# Altium schematic sheet 13_MRAM_RTC_WDT.SchDoc
size 420 x 297 mm; SheetNumber: 22; SheetTotal: 36
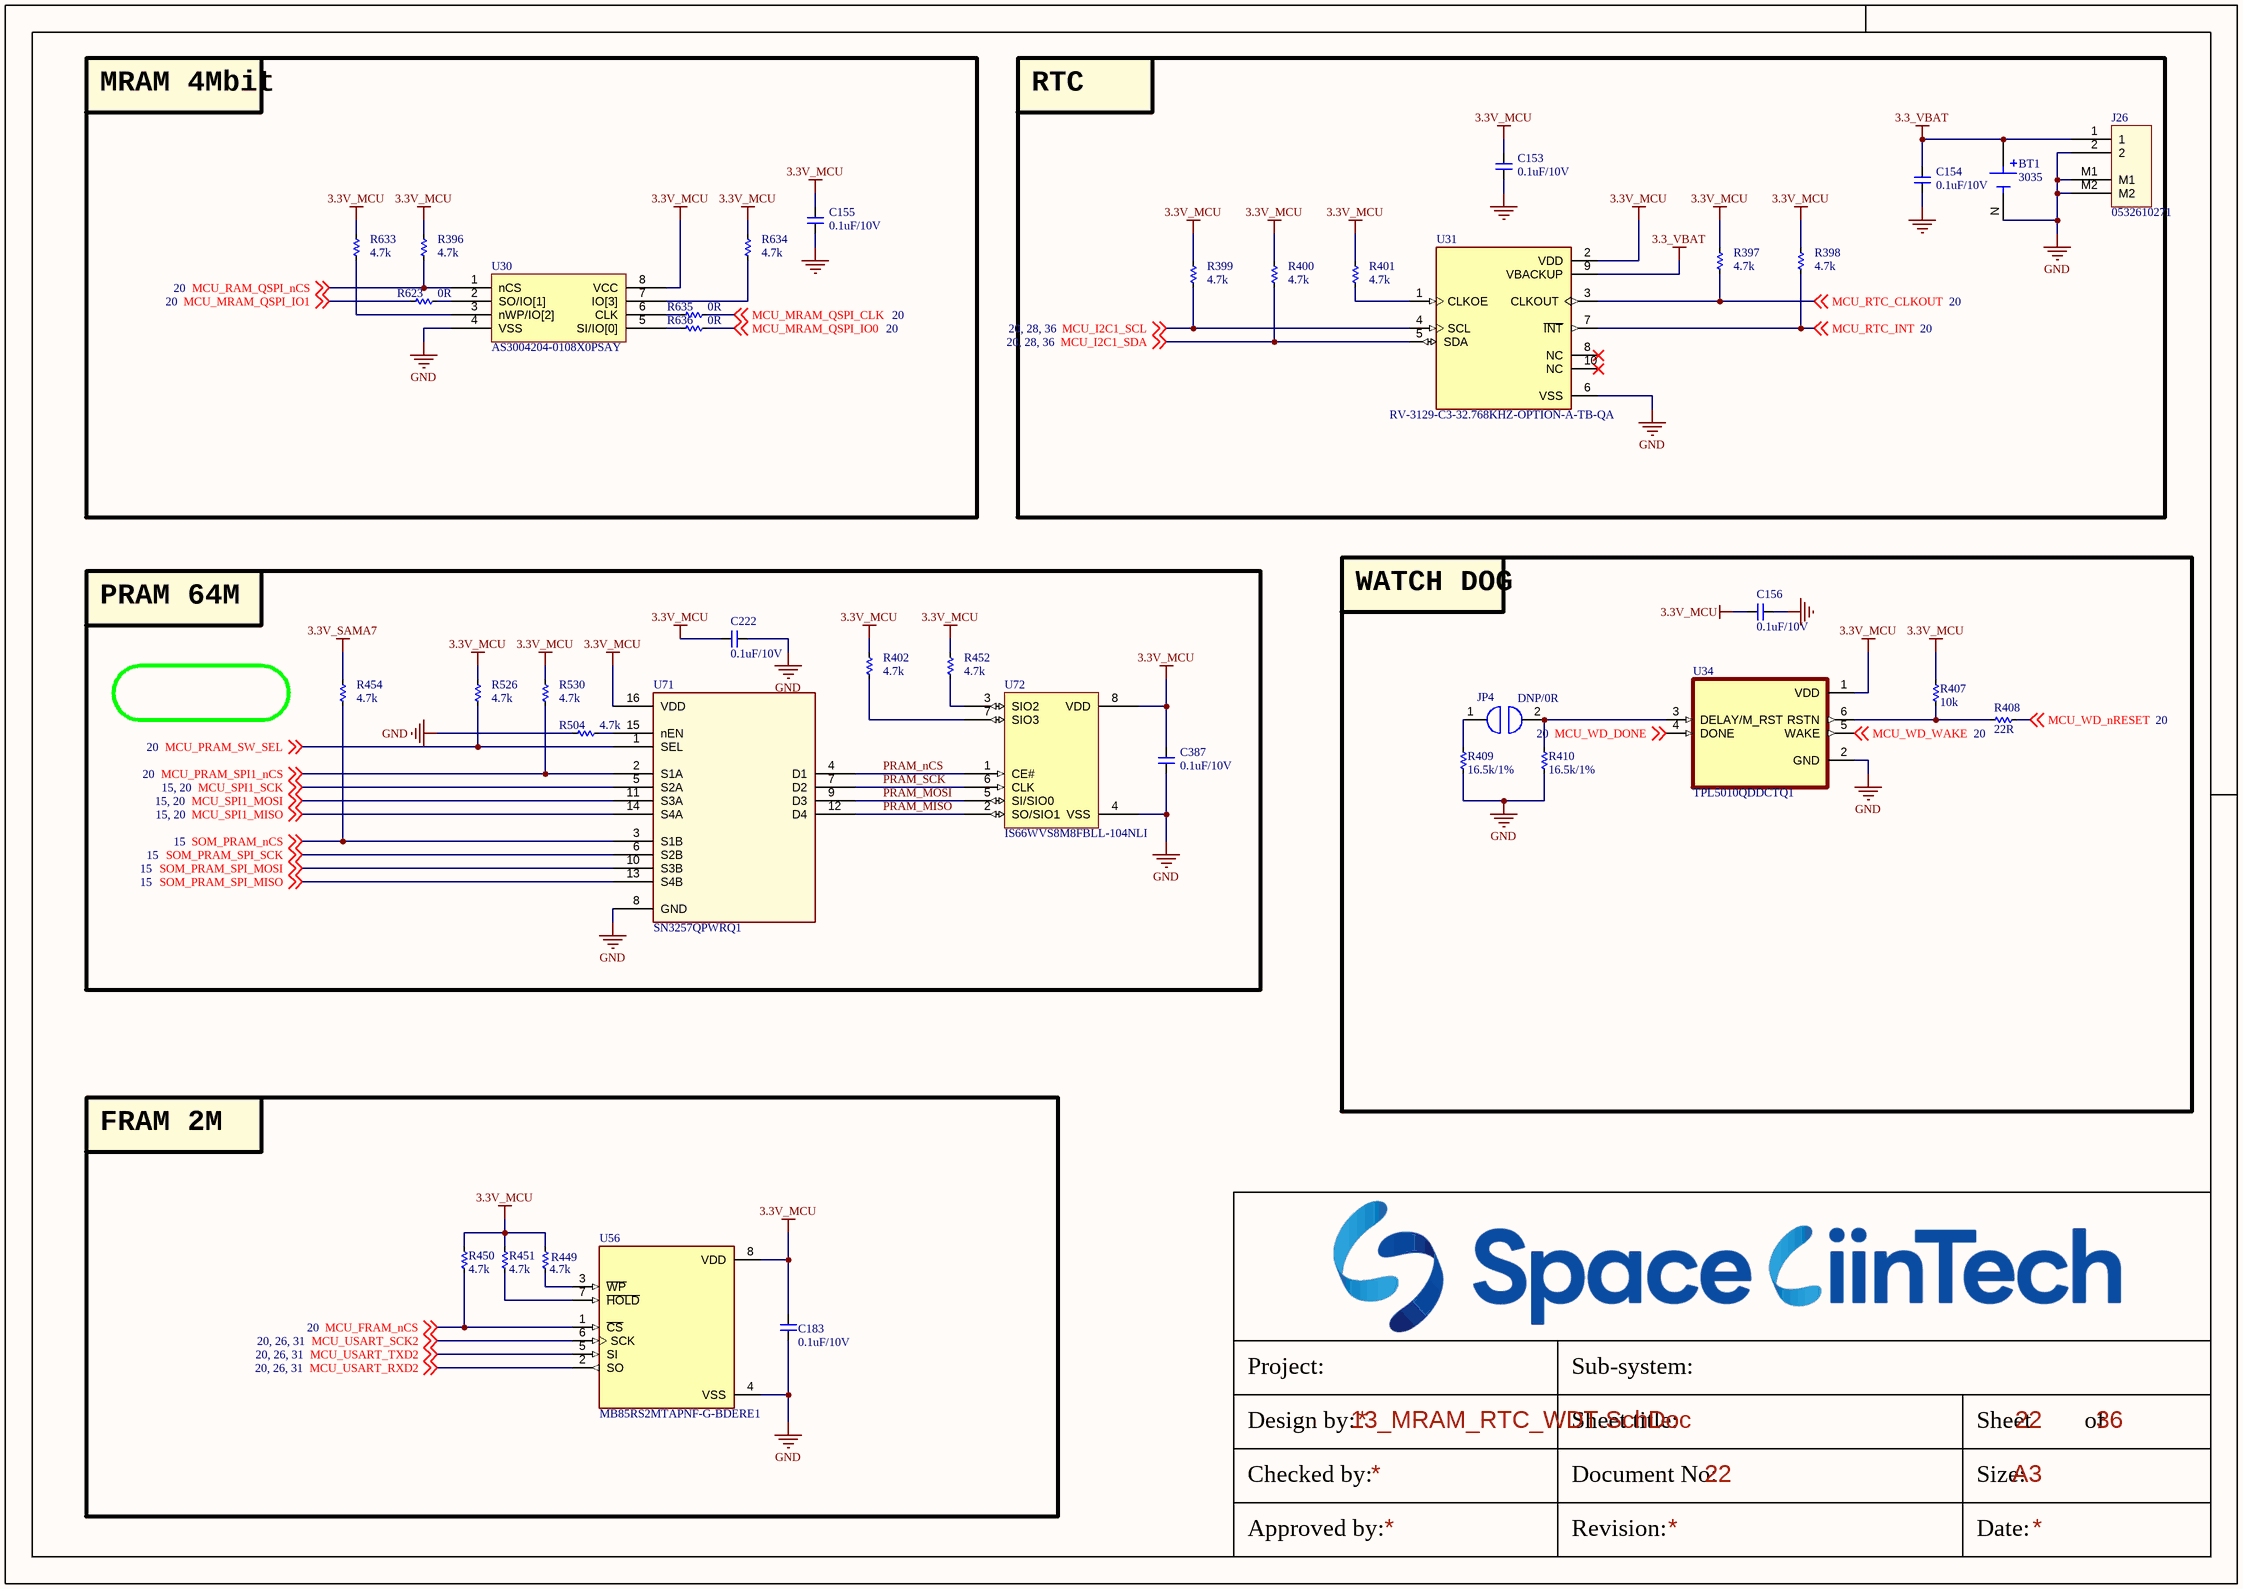
[diagram p0: 13_MRAM_RTC_WDT.SchDoc]

## Parts
BT1  3035  [BAT_3035]
C153  0.1uF/10V  [CAP_C_1005X60]
C154  0.1uF/10V  [CAP_C_1005X60]
C155  0.1uF/10V  [CAP_C_1005X60]
C156  0.1uF/10V  [CAP_C_1005X60]
C183  0.1uF/10V  [CAP_C_1005X60]
C222  0.1uF/10V  [CAP_C_1005X60]
C387  0.1uF/10V  [CAP_C_1005X60]
J26  0532610271  [molex_0532610271]
JP4  DNP/0R  [JUMPER_1608]
R396  4.7k  [RES_C_1005X40]
R397  4.7k  [RES_C_1005X40]
R398  4.7k  [RES_C_1005X40]
R399  4.7k  [RES_C_1005X40]
R400  4.7k  [RES_C_1005X40]
R401  4.7k  [RES_C_1005X40]
R402  4.7k  [RES_C_1005X40]
R407  10k  [RES_C_1005X40]
R408  22R  [RES_C_1005X40]
R409  16.5k/1%  [RES_C_1005X40]
R410  16.5k/1%  [RES_C_1005X40]
R449  4.7k  [RES_C_1005X40]
R450  4.7k  [RES_C_1005X40]
R451  4.7k  [RES_C_1005X40]
R452  4.7k  [RES_C_1005X40]
R454  4.7k  [RES_C_1005X40]
R504  4.7k  [RES_C_1005X40]
R526  4.7k  [RES_C_1005X40]
R530  4.7k  [RES_C_1005X40]
R623  0R  [RES_C_1005X40]
R633  4.7k  [RES_C_1005X40]
R634  4.7k  [RES_C_1005X40]
R635  0R  [RES_C_1005X40]
R636  0R  [RES_C_1005X40]
U30  AS3004204-0108X0PSAY  [SOIC127P790X216-8]
U31  RV-3129-C3-32.768KHZ-OPTION-A-TB-QA  [IC_RV-3129-C3_32.768KHZ_OPTION_A_TB_QA]
U34  TPL5010QDDCTQ1  [SOT95P280X145-6N]
U56  MB85RS2MTAPNF-G-BDERE1  [SOIC127P602X173-8N]
U71  SN3257QPWRQ1  [SOIC_PRQ1_TEX]
U72  IS66WVS8M8FBLL-104NLI  [SOIC8_150MIL_N_ISI]

## Blocks framed on the sheet
MRAM 4Mbit: C155 R396 R623 R633-R636 U30
RTC: BT1 C153 C154 J26 R397-R401 U31
PRAM 64M: C222 C387 R402 R452 R454 R504 R526 R530 U71 U72
WATCH DOG: C156 JP4 R407-R410 U34
FRAM 2M: C183 R449-R451 U56

## Nets
3.3_VBAT: BT1.P1(POS) BT1.P2(POS) C154.2 J26.1 U31.9(VBACKUP)
3.3V_MCU: C153.2 C155.2 C156.2 C183.2 C222.1 C387.1 R396.2 R397.2 R398.2 R399.2 R400.2 R401.1 R402.2 R407.2 R449.2 R450.2 R451.2 R452.2 R526.2 R530.2 R633.2 R634.2 U30.8(VCC) U31.2(VDD) U34.1(VDD) U56.8(VDD) U71.16(VDD) U72.8(VDD)
3.3V_SAMA7: R454.2
GND: BT1.N(NEG) C153.1 C154.1 C155.1 C156.1 C183.1 C222.2 C387.2 J26.2 J26.M1 J26.M2 R409.1 R410.1 R504.2 U30.4(VSS) U31.6(VSS) U34.2(GND) U56.4(VSS) U71.8(GND) U72.4(VSS)
MCU_FRAM_nCS: R450.1 U56.1(~{CS}) ; off-sheet MCU_FRAM_nCS
MCU_I2C1_SCL: R399.1 U31.4(SCL) ; off-sheet MCU_I2C1_SCL
MCU_I2C1_SDA: R400.1 U31.5(SDA) ; off-sheet MCU_I2C1_SDA
MCU_MRAM_QSPI_CLK: R635.1 ; off-sheet MCU_MRAM_QSPI_CLK
MCU_MRAM_QSPI_IO0: R636.1 ; off-sheet MCU_MRAM_QSPI_IO0
MCU_MRAM_QSPI_IO1: R623.2 ; off-sheet MCU_MRAM_QSPI_IO1
MCU_PRAM_SPI1_nCS: R530.1 U71.2(S1A) ; off-sheet MCU_PRAM_SPI1_nCS
MCU_PRAM_SW_SEL: R526.1 U71.1(SEL) ; off-sheet MCU_PRAM_SW_SEL
MCU_RAM_QSPI_nCS: R396.1 U30.1(nCS) ; off-sheet MCU_RAM_QSPI_nCS
MCU_RTC_CLKOUT: R397.1 U31.3(CLKOUT) ; off-sheet MCU_RTC_CLKOUT
MCU_RTC_INT: R398.1 U31.7(~{INT}) ; off-sheet MCU_RTC_INT
MCU_SPI1_MISO: U71.14(S4A) ; off-sheet MCU_SPI1_MISO
MCU_SPI1_MOSI: U71.11(S3A) ; off-sheet MCU_SPI1_MOSI
MCU_SPI1_SCK: U71.5(S2A) ; off-sheet MCU_SPI1_SCK
MCU_USART_RXD2: U56.2(SO) ; off-sheet MCU_USART_RXD2
MCU_USART_SCK2: U56.6(SCK) ; off-sheet MCU_USART_SCK2
MCU_USART_TXD2: U56.5(SI) ; off-sheet MCU_USART_TXD2
MCU_WD_DONE: U34.4(DONE) ; off-sheet MCU_WD_DONE
MCU_WD_nRESET: R408.1 ; off-sheet MCU_WD_nRESET
MCU_WD_WAKE: U34.5(WAKE) ; off-sheet MCU_WD_WAKE
PRAM_MISO: U71.12(D4) U72.2(SO/SIO1)
PRAM_MOSI: U71.9(D3) U72.5(SI/SIO0)
PRAM_nCS: U71.4(D1) U72.1(CE#)
PRAM_SCK: U71.7(D2) U72.6(CLK)
SOM_PRAM_nCS: R454.1 U71.3(S1B) ; off-sheet SOM_PRAM_nCS
SOM_PRAM_SPI_MISO: U71.13(S4B) ; off-sheet SOM_PRAM_SPI_MISO
SOM_PRAM_SPI_MOSI: U71.10(S3B) ; off-sheet SOM_PRAM_SPI_MOSI
SOM_PRAM_SPI_SCK: U71.6(S2B) ; off-sheet SOM_PRAM_SPI_SCK
NetJP4_1: JP4.1 R409.2
NetJP4_2: JP4.2 R410.2 U34.3(DELAY/M_RST)
NetR401_2: R401.2 U31.1(CLKOE)
NetR402_1: R402.1 U72.7(SIO3)
NetR407_1: R407.1 R408.2 U34.6(RSTN)
NetR449_1: R449.1 U56.3(~{WP})
NetR451_1: R451.1 U56.7(~{HOLD})
NetR452_1: R452.1 U72.3(SIO2)
NetR504_1: R504.1 U71.15(nEN)
NetR623_1: R623.1 U30.2(SO/IO[1])
NetR633_1: R633.1 U30.3(nWP/IO[2])
NetR634_1: R634.1 U30.7(IO[3])
NetR635_2: R635.2 U30.6(CLK)
NetR636_2: R636.2 U30.5(SI/IO[0])

Not connected (* = marked no-connect by the designer): U31 8(NC)* 10(NC)*

## Notes on the sheet
- Project:
- Sub-system:
- Design by:
- Sheet title:
- Sheet
- of
- Checked by:
- Approved by:
- Revision:
- Document No:
- Size:
- Date:
- A3

## Library data of the parts
BT1 = BT_HOLDER_3035: Battery Clip; THM; 20mm Cell; PhosBronze/Nickel | Keystone Electronics 3035; SnapEDA_Link: https://www.snapeda.com/parts/3035/Keystone/view-part/?ref=snap; Package: None; Value: *; MF: Keystone Electronics; MP: 3035; Check_prices: https://www.snapeda.com/parts/3035/Keystone/view-part/?ref=eda
C153-C156 C222 C387 = _CAP_C_2: CAP
C183 = _CAP_C_2: CAP CHIP
J26 = Header 2x1_2M
JP4 = JUMPER
R396-R402 R407-R410 R449-R452 R454 R504 R526 R530 R623 R633-R636 = _RES_B_2: RES
U30 = IC_RAM_AS3004204-0108X0PSAY
U31 = RV-3129-C3_32.768KHZ_OPTION_A_TB_QA: Real-Time Clock Module, Temperature compensated, in 2.5 x 3.7 mm package; MF: Micro Crystal; MP: RV-3129-C3 32.768KHZ OPTION A TB QA; SnapEDA_Link: https://www.snapeda.com/parts/RV-3129-C3%2032.768KHZ%20OPTION%20A%20TB%20QA/Micro+Crystal/view-part/?ref=snap; Package: QFN-10 Micro Crystal; Value: *; Check_prices: https://www.snapeda.com/parts/RV-3129-C3%2032.768KHZ%20OPTION%20A%20TB%20QA/Micro+Crystal/view-part/?ref=eda
U56 = MB85RS2MTAPNF-G-BDERE1: FRAM _Ferroelectric RAM_ Memory IC 2Mb _256K x 8_ SPI 40MHz 8-SOP; MF: Fujitsu Electronics; Package: SO-8 Fujitsu; Value: *; Digi-Key_Purchase_URL: https://www.digikey.com/product-detail/en/fujitsu-electronics-america-inc/MB85RS2MTAPNF-G-BDERE1/865-1286-1-ND/7916252?utm_source=snapeda&utm_medium=aggregator&utm_campaign=symbol; Digi-Key_Part_Number: 865-1286-1-ND; SnapEDA_Link: https://www.snapeda.com/parts/MB85RS2MTAPNF-G-BDERE1/Fujitsu%20Electronics%20America%2C%20Inc./view-part/2344795/?ref=snap; MP: MB85RS2MTAPNF-G-BDERE1
U71 = IC_SW_SPI_SN3257QPWRQ1: Automotive 5-V, 2:1 (SPDT), 4-channel switch with 1.8-V logic and powered-off protection 16-TSSOP -40 to 125; Manufacturer_Name: Texas Instruments; Copyright: Copyright (C) 2025 Ultra Librarian. All rights reserved.; Manufacturer_Part_Number: SN3257QPWRQ1; Datasheet: https://www.ti.com/lit/gpn/sn3257-q1; RefDes: RefDes; Type: Type
U72 = IS66WVS4M8BLL-104NLI: No Description Available; Manufacturer_Name: ISSI; Type: Memory; Copyright: Copyright (C) 2025 Ultra Librarian. All rights reserved.; Manufacturer_Part_Number: IS66WVS4M8BLL-104NLI; RefDes: RefDes
U34 = TPL5010QDDCTQ1: Package: None; Price: None; Value: *; MP: TPL5010QDDCTQ1; Availability: Unavailable